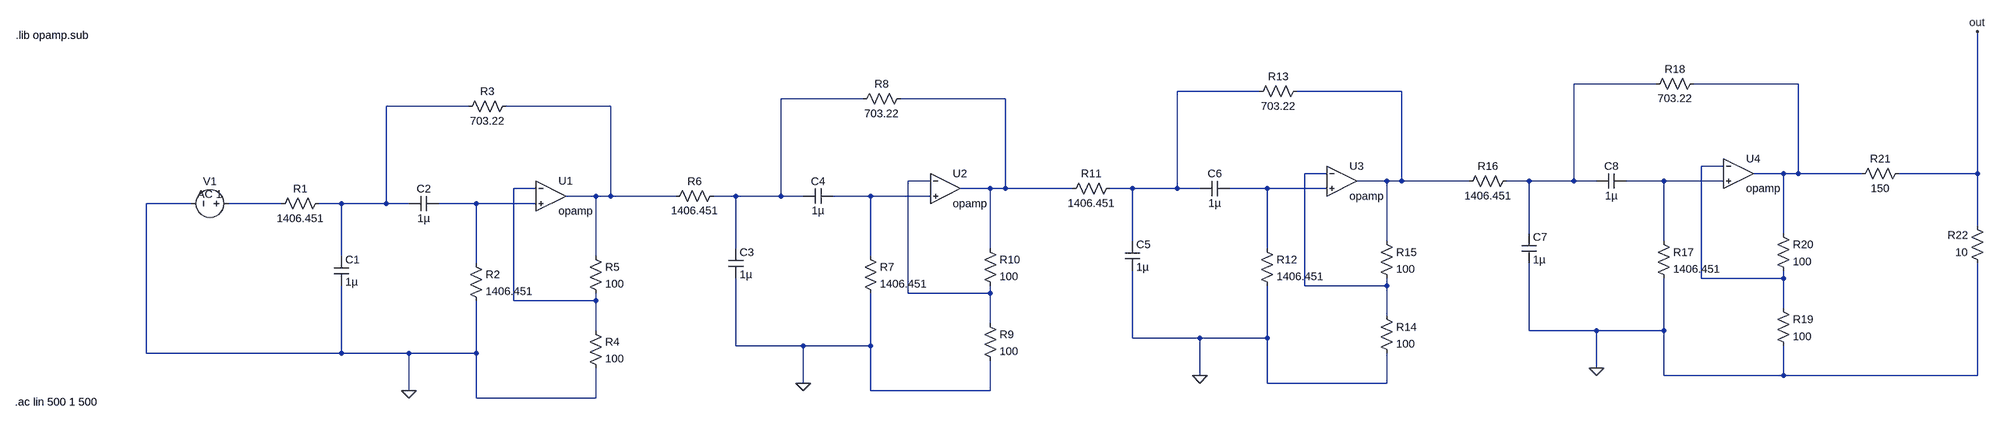
[diagram p0: schematic IMT2019508_filter.asc]
IMT2019508_filter.asc, the LTspice schematic file:
Version 4
SHEET 1 4164 680
WIRE 3296 -368 3120 -368
WIRE 3600 -368 3376 -368
WIRE 2336 -352 2160 -352
WIRE 2640 -352 2416 -352
WIRE 1488 -336 1312 -336
WIRE 1792 -336 1568 -336
WIRE 336 -320 160 -320
WIRE 640 -320 416 -320
WIRE 3440 -192 3392 -192
WIRE 2480 -176 2432 -176
WIRE 3568 -176 3504 -176
WIRE 3600 -176 3600 -368
WIRE 3600 -176 3568 -176
WIRE 3872 -176 3600 -176
WIRE 4128 -176 4128 -480
WIRE 4128 -176 3952 -176
WIRE 1632 -160 1584 -160
WIRE 2608 -160 2544 -160
WIRE 2640 -160 2640 -352
WIRE 2640 -160 2608 -160
WIRE 2896 -160 2640 -160
WIRE 3024 -160 2976 -160
WIRE 3120 -160 3120 -368
WIRE 3120 -160 3024 -160
WIRE 3168 -160 3120 -160
WIRE 3312 -160 3232 -160
WIRE 3440 -160 3312 -160
WIRE 480 -144 432 -144
WIRE 1760 -144 1696 -144
WIRE 1792 -144 1792 -336
WIRE 1792 -144 1760 -144
WIRE 1936 -144 1792 -144
WIRE 2064 -144 2016 -144
WIRE 2160 -144 2160 -352
WIRE 2160 -144 2064 -144
WIRE 2208 -144 2160 -144
WIRE 2352 -144 2272 -144
WIRE 2480 -144 2352 -144
WIRE 608 -128 544 -128
WIRE 640 -128 640 -320
WIRE 640 -128 608 -128
WIRE 1088 -128 640 -128
WIRE 1216 -128 1168 -128
WIRE 1312 -128 1312 -336
WIRE 1312 -128 1216 -128
WIRE 1360 -128 1312 -128
WIRE 1504 -128 1424 -128
WIRE 1632 -128 1504 -128
WIRE -304 -112 -400 -112
WIRE -64 -112 -224 -112
WIRE 64 -112 16 -112
WIRE 160 -112 160 -320
WIRE 160 -112 64 -112
WIRE 208 -112 160 -112
WIRE 352 -112 272 -112
WIRE 480 -112 352 -112
WIRE 4128 -64 4128 -176
WIRE 3024 -48 3024 -160
WIRE 3568 -48 3568 -176
WIRE 2064 -32 2064 -144
WIRE 2608 -32 2608 -160
WIRE 3312 -32 3312 -160
WIRE 1216 -16 1216 -128
WIRE 1760 -16 1760 -144
WIRE 2352 -16 2352 -144
WIRE 64 0 64 -112
WIRE 608 0 608 -128
WIRE 1504 0 1504 -128
WIRE 352 16 352 -112
WIRE 3392 48 3392 -192
WIRE 3568 48 3568 32
WIRE 3568 48 3392 48
WIRE 2432 64 2432 -176
WIRE 2608 64 2608 48
WIRE 2608 64 2432 64
WIRE 1584 80 1584 -160
WIRE 1760 80 1760 64
WIRE 1760 80 1584 80
WIRE 432 96 432 -144
WIRE 608 96 608 80
WIRE 608 96 432 96
WIRE 3568 112 3568 48
WIRE 2608 128 2608 64
WIRE 1760 144 1760 80
WIRE 608 160 608 96
WIRE 3024 160 3024 16
WIRE 3168 160 3024 160
WIRE 3312 160 3312 48
WIRE 3312 160 3168 160
WIRE 2064 176 2064 32
WIRE 2208 176 2064 176
WIRE 2352 176 2352 64
WIRE 2352 176 2208 176
WIRE 1216 192 1216 48
WIRE 1360 192 1216 192
WIRE 1504 192 1504 80
WIRE 1504 192 1360 192
WIRE -400 208 -400 -112
WIRE 64 208 64 64
WIRE 64 208 -400 208
WIRE 208 208 64 208
WIRE 352 208 352 96
WIRE 352 208 208 208
WIRE 3168 240 3168 160
WIRE 2208 256 2208 176
WIRE 3312 256 3312 160
WIRE 3568 256 3568 192
WIRE 3568 256 3312 256
WIRE 4128 256 4128 16
WIRE 4128 256 3568 256
WIRE 1360 272 1360 192
WIRE 2352 272 2352 176
WIRE 2608 272 2608 208
WIRE 2608 272 2352 272
WIRE 208 288 208 208
WIRE 1504 288 1504 192
WIRE 1760 288 1760 224
WIRE 1760 288 1504 288
WIRE 352 304 352 208
WIRE 608 304 608 240
WIRE 608 304 352 304
FLAG 208 288 0
FLAG 1360 272 0
FLAG 2208 256 0
FLAG 3168 240 0
FLAG 4128 -480 out
SYMBOL cap 48 0 R0
SYMATTR InstName C1
SYMATTR Value 1µ
SYMBOL cap 272 -128 R90
WINDOW 0 0 32 VBottom 2
WINDOW 3 32 32 VTop 2
SYMATTR InstName C2
SYMATTR Value 1µ
SYMBOL res 32 -128 R90
WINDOW 0 0 56 VBottom 2
WINDOW 3 32 56 VTop 2
SYMATTR InstName R1
SYMATTR Value 1406.451
SYMBOL res 336 0 R0
SYMATTR InstName R2
SYMATTR Value 1406.451
SYMBOL res 432 -336 R90
WINDOW 0 0 56 VBottom 2
WINDOW 3 32 56 VTop 2
SYMATTR InstName R3
SYMATTR Value 703.22
SYMBOL res 592 144 R0
SYMATTR InstName R4
SYMATTR Value 100
SYMBOL voltage -208 -112 R90
WINDOW 0 -32 56 VBottom 2
WINDOW 3 -4 56 VBottom 2
WINDOW 123 -4 56 VBottom 2
WINDOW 39 0 0 Left 0
SYMATTR InstName V1
SYMATTR Value ""
SYMATTR Value2 AC 1
SYMBOL res 592 -16 R0
SYMATTR InstName R5
SYMATTR Value 100
SYMBOL OpAmps\\opamp 512 -192 R0
SYMATTR InstName U1
SYMBOL cap 1200 -16 R0
SYMATTR InstName C3
SYMATTR Value 1µ
SYMBOL cap 1424 -144 R90
WINDOW 0 0 32 VBottom 2
WINDOW 3 32 32 VTop 2
SYMATTR InstName C4
SYMATTR Value 1µ
SYMBOL res 1184 -144 R90
WINDOW 0 0 56 VBottom 2
WINDOW 3 32 56 VTop 2
SYMATTR InstName R6
SYMATTR Value 1406.451
SYMBOL res 1488 -16 R0
SYMATTR InstName R7
SYMATTR Value 1406.451
SYMBOL res 1584 -352 R90
WINDOW 0 0 56 VBottom 2
WINDOW 3 32 56 VTop 2
SYMATTR InstName R8
SYMATTR Value 703.22
SYMBOL res 1744 128 R0
SYMATTR InstName R9
SYMATTR Value 100
SYMBOL res 1744 -32 R0
SYMATTR InstName R10
SYMATTR Value 100
SYMBOL OpAmps\\opamp 1664 -208 R0
SYMATTR InstName U2
SYMBOL cap 2048 -32 R0
SYMATTR InstName C5
SYMATTR Value 1µ
SYMBOL cap 2272 -160 R90
WINDOW 0 0 32 VBottom 2
WINDOW 3 32 32 VTop 2
SYMATTR InstName C6
SYMATTR Value 1µ
SYMBOL res 2032 -160 R90
WINDOW 0 0 56 VBottom 2
WINDOW 3 32 56 VTop 2
SYMATTR InstName R11
SYMATTR Value 1406.451
SYMBOL res 2336 -32 R0
SYMATTR InstName R12
SYMATTR Value 1406.451
SYMBOL res 2432 -368 R90
WINDOW 0 0 56 VBottom 2
WINDOW 3 32 56 VTop 2
SYMATTR InstName R13
SYMATTR Value 703.22
SYMBOL res 2592 112 R0
SYMATTR InstName R14
SYMATTR Value 100
SYMBOL res 2592 -48 R0
SYMATTR InstName R15
SYMATTR Value 100
SYMBOL OpAmps\\opamp 2512 -224 R0
SYMATTR InstName U3
SYMBOL cap 3008 -48 R0
SYMATTR InstName C7
SYMATTR Value 1µ
SYMBOL cap 3232 -176 R90
WINDOW 0 0 32 VBottom 2
WINDOW 3 32 32 VTop 2
SYMATTR InstName C8
SYMATTR Value 1µ
SYMBOL res 2992 -176 R90
WINDOW 0 0 56 VBottom 2
WINDOW 3 32 56 VTop 2
SYMATTR InstName R16
SYMATTR Value 1406.451
SYMBOL res 3296 -48 R0
SYMATTR InstName R17
SYMATTR Value 1406.451
SYMBOL res 3392 -384 R90
WINDOW 0 0 56 VBottom 2
WINDOW 3 32 56 VTop 2
SYMATTR InstName R18
SYMATTR Value 703.22
SYMBOL res 3552 96 R0
SYMATTR InstName R19
SYMATTR Value 100
SYMBOL res 3552 -64 R0
SYMATTR InstName R20
SYMATTR Value 100
SYMBOL OpAmps\\opamp 3472 -240 R0
SYMATTR InstName U4
SYMBOL res 3968 -192 R90
WINDOW 0 0 56 VBottom 2
WINDOW 3 32 56 VTop 2
SYMATTR InstName R21
SYMATTR Value 150
SYMBOL res 4144 32 R180
WINDOW 0 36 76 Left 2
WINDOW 3 36 40 Left 2
SYMATTR InstName R22
SYMATTR Value 10
TEXT -704 -472 Left 2 !.lib opamp.sub
TEXT -706 312 Left 2 !.ac lin 500 1 500

The netlist it stands for:
* IMT2019508_filter.asc
C1 N007 0 1µ
C2 N017 N007 1µ
R1 N007 N016 1406.451
R2 N017 0 1406.451
R3 N008 N007 703.22
R4 N013 0 100
V1 N016 0 AC 1
R5 N008 N013 100
XU1 N013 N017 N008 opamp Aol=100K GBW=10Meg  ; pins invin noninvin out
C3 N005 0 1µ
C4 N015 N005 1µ
R6 N005 N008 1406.451
R7 N015 0 1406.451
R8 N006 N005 703.22
R9 N011 0 100
R10 N006 N011 100
XU2 N011 N015 N006 opamp Aol=100K GBW=10Meg  ; pins invin noninvin out
C5 N003 0 1µ
C6 N014 N003 1µ
R11 N003 N006 1406.451
R12 N014 0 1406.451
R13 N004 N003 703.22
R14 N010 0 100
R15 N004 N010 100
XU3 N010 N014 N004 opamp Aol=100K GBW=10Meg  ; pins invin noninvin out
C7 N001 0 1µ
C8 N012 N001 1µ
R16 N001 N004 1406.451
R17 N012 0 1406.451
R18 N002 N001 703.22
R19 N009 0 100
R20 N002 N009 100
XU4 N009 N012 N002 opamp Aol=100K GBW=10Meg  ; pins invin noninvin out
R21 out N002 150
R22 0 out 10
.lib opamp.sub
.ac lin 500 1 500
.backanno
.end